# Altium schematic sheet Audio Amplifier.SchDoc
size A
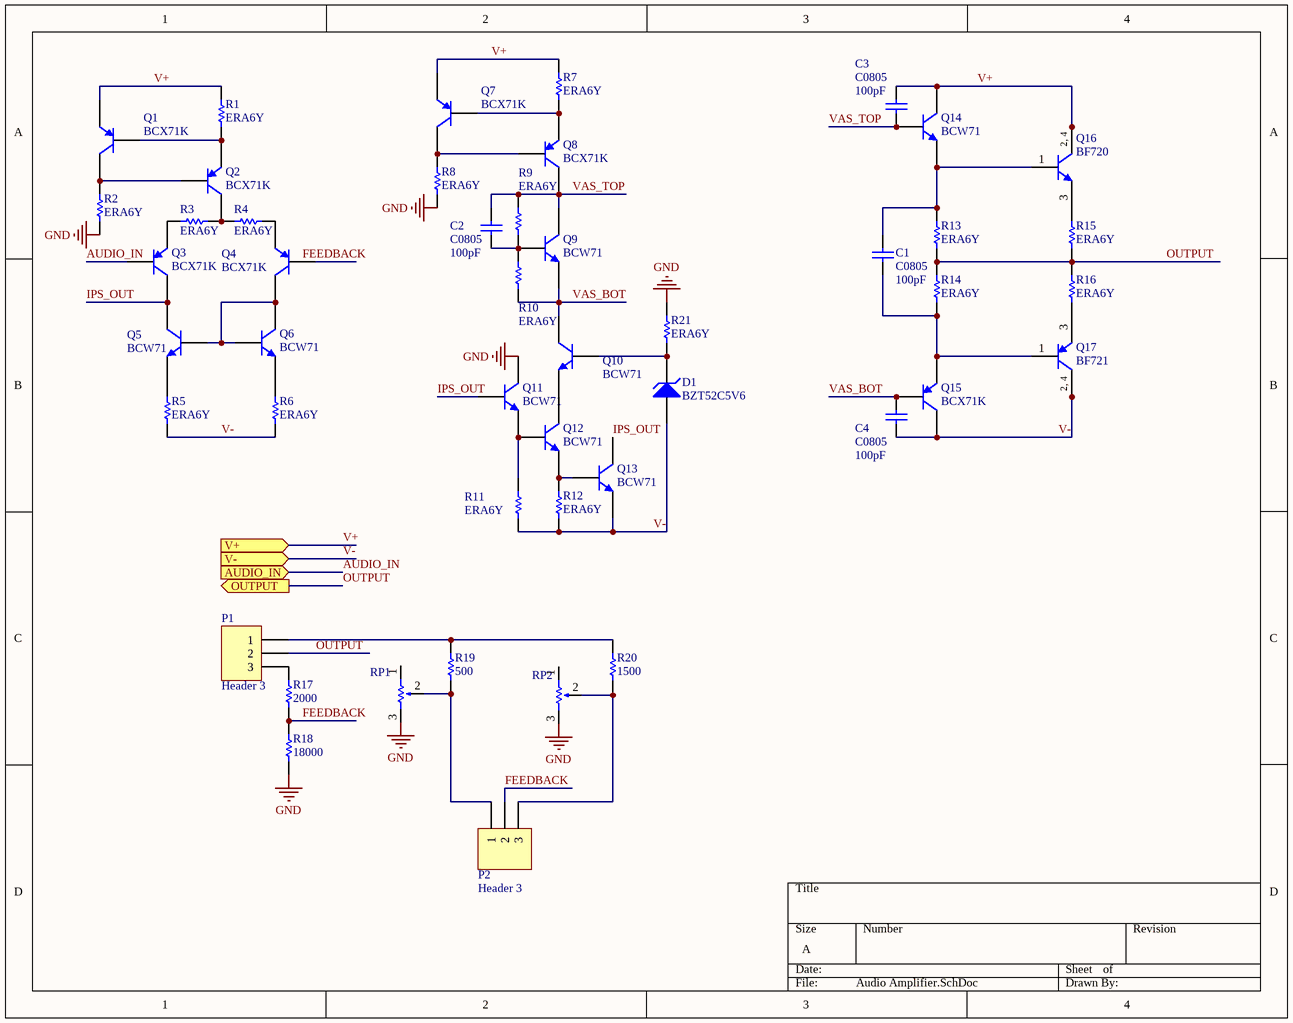
[diagram p0: Audio Amplifier.SchDoc]

## Parts
C1  C0805  value 100pF  [0805]
C2  C0805  value 100pF  [0805]
C3  C0805  value 100pF  [0805]
C4  C0805  value 100pF  [0805]
D1  BZT52C5V6  [SOD-123]
P1  Header 3  [HDR1X3]
P2  Header 3  [HDR1X3]
Q1  BCX71K  [SOT-23B_N]
Q2  BCX71K  [SOT-23B_N]
Q3  BCX71K  [SOT-23B_N]
Q4  BCX71K  [SOT-23B_N]
Q5  BCW71  [SOT-23B_N]
Q6  BCW71  [SOT-23B_N]
Q7  BCX71K  [SOT-23B_N]
Q8  BCX71K  [SOT-23B_N]
Q9  BCW71  [SOT-23B_N]
Q10  BCW71  [SOT-23B_N]
Q11  BCW71  [SOT-23B_N]
Q12  BCW71  [SOT-23B_N]
Q13  BCW71  [SOT-23B_N]
Q14  BCW71  [SOT-23B_N]
Q15  BCX71K  [SOT-23B_N]
Q16  BF720  [SOT-223]
Q17  BF721  [SOT-223]
R1  ERA6Y  [ERA-0805]
R2  ERA6Y  [ERA-0805]
R3  ERA6Y  [ERA-0805]
R4  ERA6Y  [ERA-0805]
R5  ERA6Y  [ERA-0805]
R6  ERA6Y  [ERA-0805]
R7  ERA6Y  [ERA-0805]
R8  ERA6Y  [ERA-0805]
R9  ERA6Y  [ERA-0805]
R10  ERA6Y  [ERA-0805]
R11  ERA6Y  [ERA-0805]
R12  ERA6Y  [ERA-0805]
R13  ERA6Y  [ERA-0805]
R14  ERA6Y  [ERA-0805]
R15  ERA6Y  [ERA-0805]
R16  ERA6Y  [ERA-0805]
R17  2000  [ERA-0805]
R18  18000  [ERA-0805]
R19  500  [ERA-0805]
R20  1500  [ERA-0805]
R21  ERA6Y  [ERA-0805]
RP1  Panasonic Potentiometer  [Panasonic Potentiometer]  (value not drawn)
RP2  Panasonic Potentiometer  [Panasonic Potentiometer]  (value not drawn)

## Ports
AUDIO_IN (in), OUTPUT (out), V+ (in), V- (in)

## Nets
GND: Q11.3(C) R2.1 R8.1 R18.1 R21.2 RP1.3 RP2.3
AUDIO_IN: Q3.1(B) ; port AUDIO_IN
FEEDBACK: P2.2 R17.1 R18.2
IPS_OUT: Q3.3(C) Q5.3(C) Q11.1(B) Q13.3(C)
OUTPUT: P1.2 R13.1 R14.2 R15.1 R16.2 ; port OUTPUT
V+: C3.2 Q1.2(E) Q7.2(E) Q14.3(C) Q16.2(C) Q16.4(C) R1.2 R7.2 ; port V+
V-: C4.1 D1.1(A) Q13.2(E) Q15.3(C) Q17.2(C) Q17.4(C) R5.2 R6.2 R11.1 R12.1 ; port V-
VAS_BOT: C4.2 Q9.2(E) Q10.3(C) Q15.1(B) R9.1
VAS_TOP: C2.2 C3.1 Q8.3(C) Q9.3(C) Q14.1(B) R10.2
NetC1_1: C1.1 Q15.2(E) Q17.1(B) R14.1
NetC1_2: C1.2 Q14.2(E) Q16.1(B) R13.2
NetC2_1: C2.1 Q9.1(B) R9.2 R10.1
NetD1_2: D1.2(K) Q10.1(B) R21.1
NetP1_1: P1.1 R19.2 R20.2
NetP1_3: P1.3 R17.2
NetP2_1: P2.1 R19.1 RP1.2
NetP2_3: P2.3 R20.1 RP2.2
NetQ1_1: Q1.1(B) Q2.2(E) R1.1
NetQ1_3: Q1.3(C) Q2.1(B) R2.2
NetQ2_3: Q2.3(C) R3.1 R4.2
NetQ3_2: Q3.2(E) R3.2
NetQ4_2: Q4.2(E) R4.1
NetQ4_3: Q4.3(C) Q5.1(B) Q6.1(B) Q6.3(C)
NetQ5_2: Q5.2(E) R5.1
NetQ6_2: Q6.2(E) R6.1
NetQ7_1: Q7.1(B) Q8.2(E) R7.1
NetQ7_3: Q7.3(C) Q8.1(B) R8.2
NetQ10_2: Q10.2(E) Q12.3(C)
NetQ11_2: Q11.2(E) Q12.1(B) R11.2
NetQ12_2: Q12.2(E) Q13.1(B) R12.2
NetQ16_3: Q16.3(E) R15.2
NetQ17_3: Q17.3(E) R16.1

Not connected (* = marked no-connect by the designer): Q4 1(B); RP1 1; RP2 1

## Notes on the sheet
- Labels drawn without touching a wire or pin: FEEDBACK
- (in symbol BF720) 2, 4
- (in symbol BF721) 2, 4

## Library data of the parts
C1-C4 = C0805: Ceramic Chip Capacitor - Standard; Note: Footprint corresponds to dimensions for bulk cassette packaging. This case size has tightened tolerances.; Published: 17-Jul-2002; LatestRevisionDate: 19-Mar-2004; LatestRevisionNote: Silkscreen size reduced.; DatasheetDocument: Mar-2001; PackageDocument: Mar-2001; PackageReference: 0805; Publisher: Altium Limited; Code_JEITA: 0805; Code_IPC: 2012[0805]; ComponentLink1Description: Manufacturer Link; ComponentLink1URL: http://www.kemet.com/; ComponentLink2Description: Datasheet; ComponentLink2URL: http://www.kemet.com/kemet/web/homepage/kechome.nsf/vapubfilesname/F3102TA.pdf/$file/F3102TA.pdf
D1 = BZT52C5V6: Surface Mount Zener Diode; Published: 8-Jun-2000; LatestRevisionDate: 17-Jul-2002; LatestRevisionNote: Re-released for DXP Platform.; DatasheetDocument: REV. L-2; PackageReference: SOD-123; Publisher: Altium Limited; ComponentLink1Description: Manufacturer Link; ComponentLink1URL: http://www.vishay.com/
P1 P2 = Header 3: Header, 3-Pin; LatestRevisionDate: 17-Jul-2002; LatestRevisionNote: Re-released for DXP Platform.; Publisher: Altium Limited
Q1-Q4 Q7 Q8 Q15 = BCX71K: PNP Epitaxial Silicon Transistor; Published: 8-Jun-2000; LatestRevisionDate: 20-Nov-2009; LatestRevisionNote: IPC-7351 Footprint Added.; DatasheetVersion: 1999; PackageVersion: Aug-1999; PackageReference: SOT-23B; Publisher: Altium Limited; PackageDescription: 3-Pin SOT-23 Package 0.95 mm Pitch, 2.4 mm Lead Span; ComponentLink1Description: Manufacturer Link; ComponentLink1URL: http://www.fairchildsemi.com/; ComponentLink2Description: Datasheet; ComponentLink2URL: http://www.fairchildsemi.com/ds/BC%2FBCX71K.pdf
Q5 Q6 Q9-Q14 = BCW71: NPN Epitaxial Silicon Transistor; Published: 8-Jun-2000; LatestRevisionDate: 20-Nov-2009; LatestRevisionNote: IPC-7351 Footprint Added.; DatasheetVersion: 1999; PackageVersion: Aug-1999; PackageReference: SOT-23B; Publisher: Altium Limited; PackageDescription: 3-Pin SOT-23 Package 0.95 mm Pitch, 2.4 mm Lead Span; ComponentLink1Description: Manufacturer Link; ComponentLink1URL: http://www.fairchildsemi.com/; ComponentLink2Description: Datasheet; ComponentLink2URL: http://www.fairchildsemi.com/ds/BC%2FBCW71.pdf
Q16 = BF720: NPN Silicon High-Voltage Transistor; Published: 8-Jun-2000; DatasheetDocument: May-1991; PackageDocument: Sep-2000; PackageReference: SOT-223; Publisher: Altium Limited; ComponentLink1Description: Manufacturer Link; ComponentLink1URL: http://www.infineon.com/; ComponentLink2Description: Datasheet; ComponentLink2URL: http://www.infineon.convergy.de/upload/documents/techdoc/GF_32/bf720.pdf
Q17 = BF721: PNP Silicon High-Voltage Transistor; Published: 8-Jun-2000; DatasheetDocument: Jul-1994; PackageDocument: Sep-2000; PackageReference: SOT-223; Publisher: Altium Limited; ComponentLink1Description: Manufacturer Link; ComponentLink1URL: http://www.infineon.com/; ComponentLink2Description: Datasheet; ComponentLink2URL: http://www.infineon.convergy.de/upload/documents/techdoc/GF_32/bf721.pdf
R1-R21 = ERA6Y: Rectangular Thick Film Chip Resistor, 10 Ohm to 1M Ohm Range, 0.1% and 0.5% Tolerance, 0805 Size, 0.1 W; Note: If flow soldering, adjust pad width of PCB Footprint to 0.7 - 0.8 times the width of the resistor.; Published: 17-Dec-2003; LatestRevisionDate: 19-Mar-2004; LatestRevisionNote: Silkscreen size reduced.; PackageDocument: Mar-2003; PackageReference: ERA-0805; Publisher: Altium Limited; Code_IPC: 2012 [0805]; ComponentLink1Description: Manufacturer Link; ComponentLink1URL: http://www.panasonic.com/industrial/components/resistive_products.htm; ComponentLink2Description: Datasheet; ComponentLink2URL: http://www.panasonic.com/industrial/components/pdf/AOA0000CE8.pdf